# EAGLE design esphome-lg-pqrcuds0-rev1 (EAGLE 9.6.2)
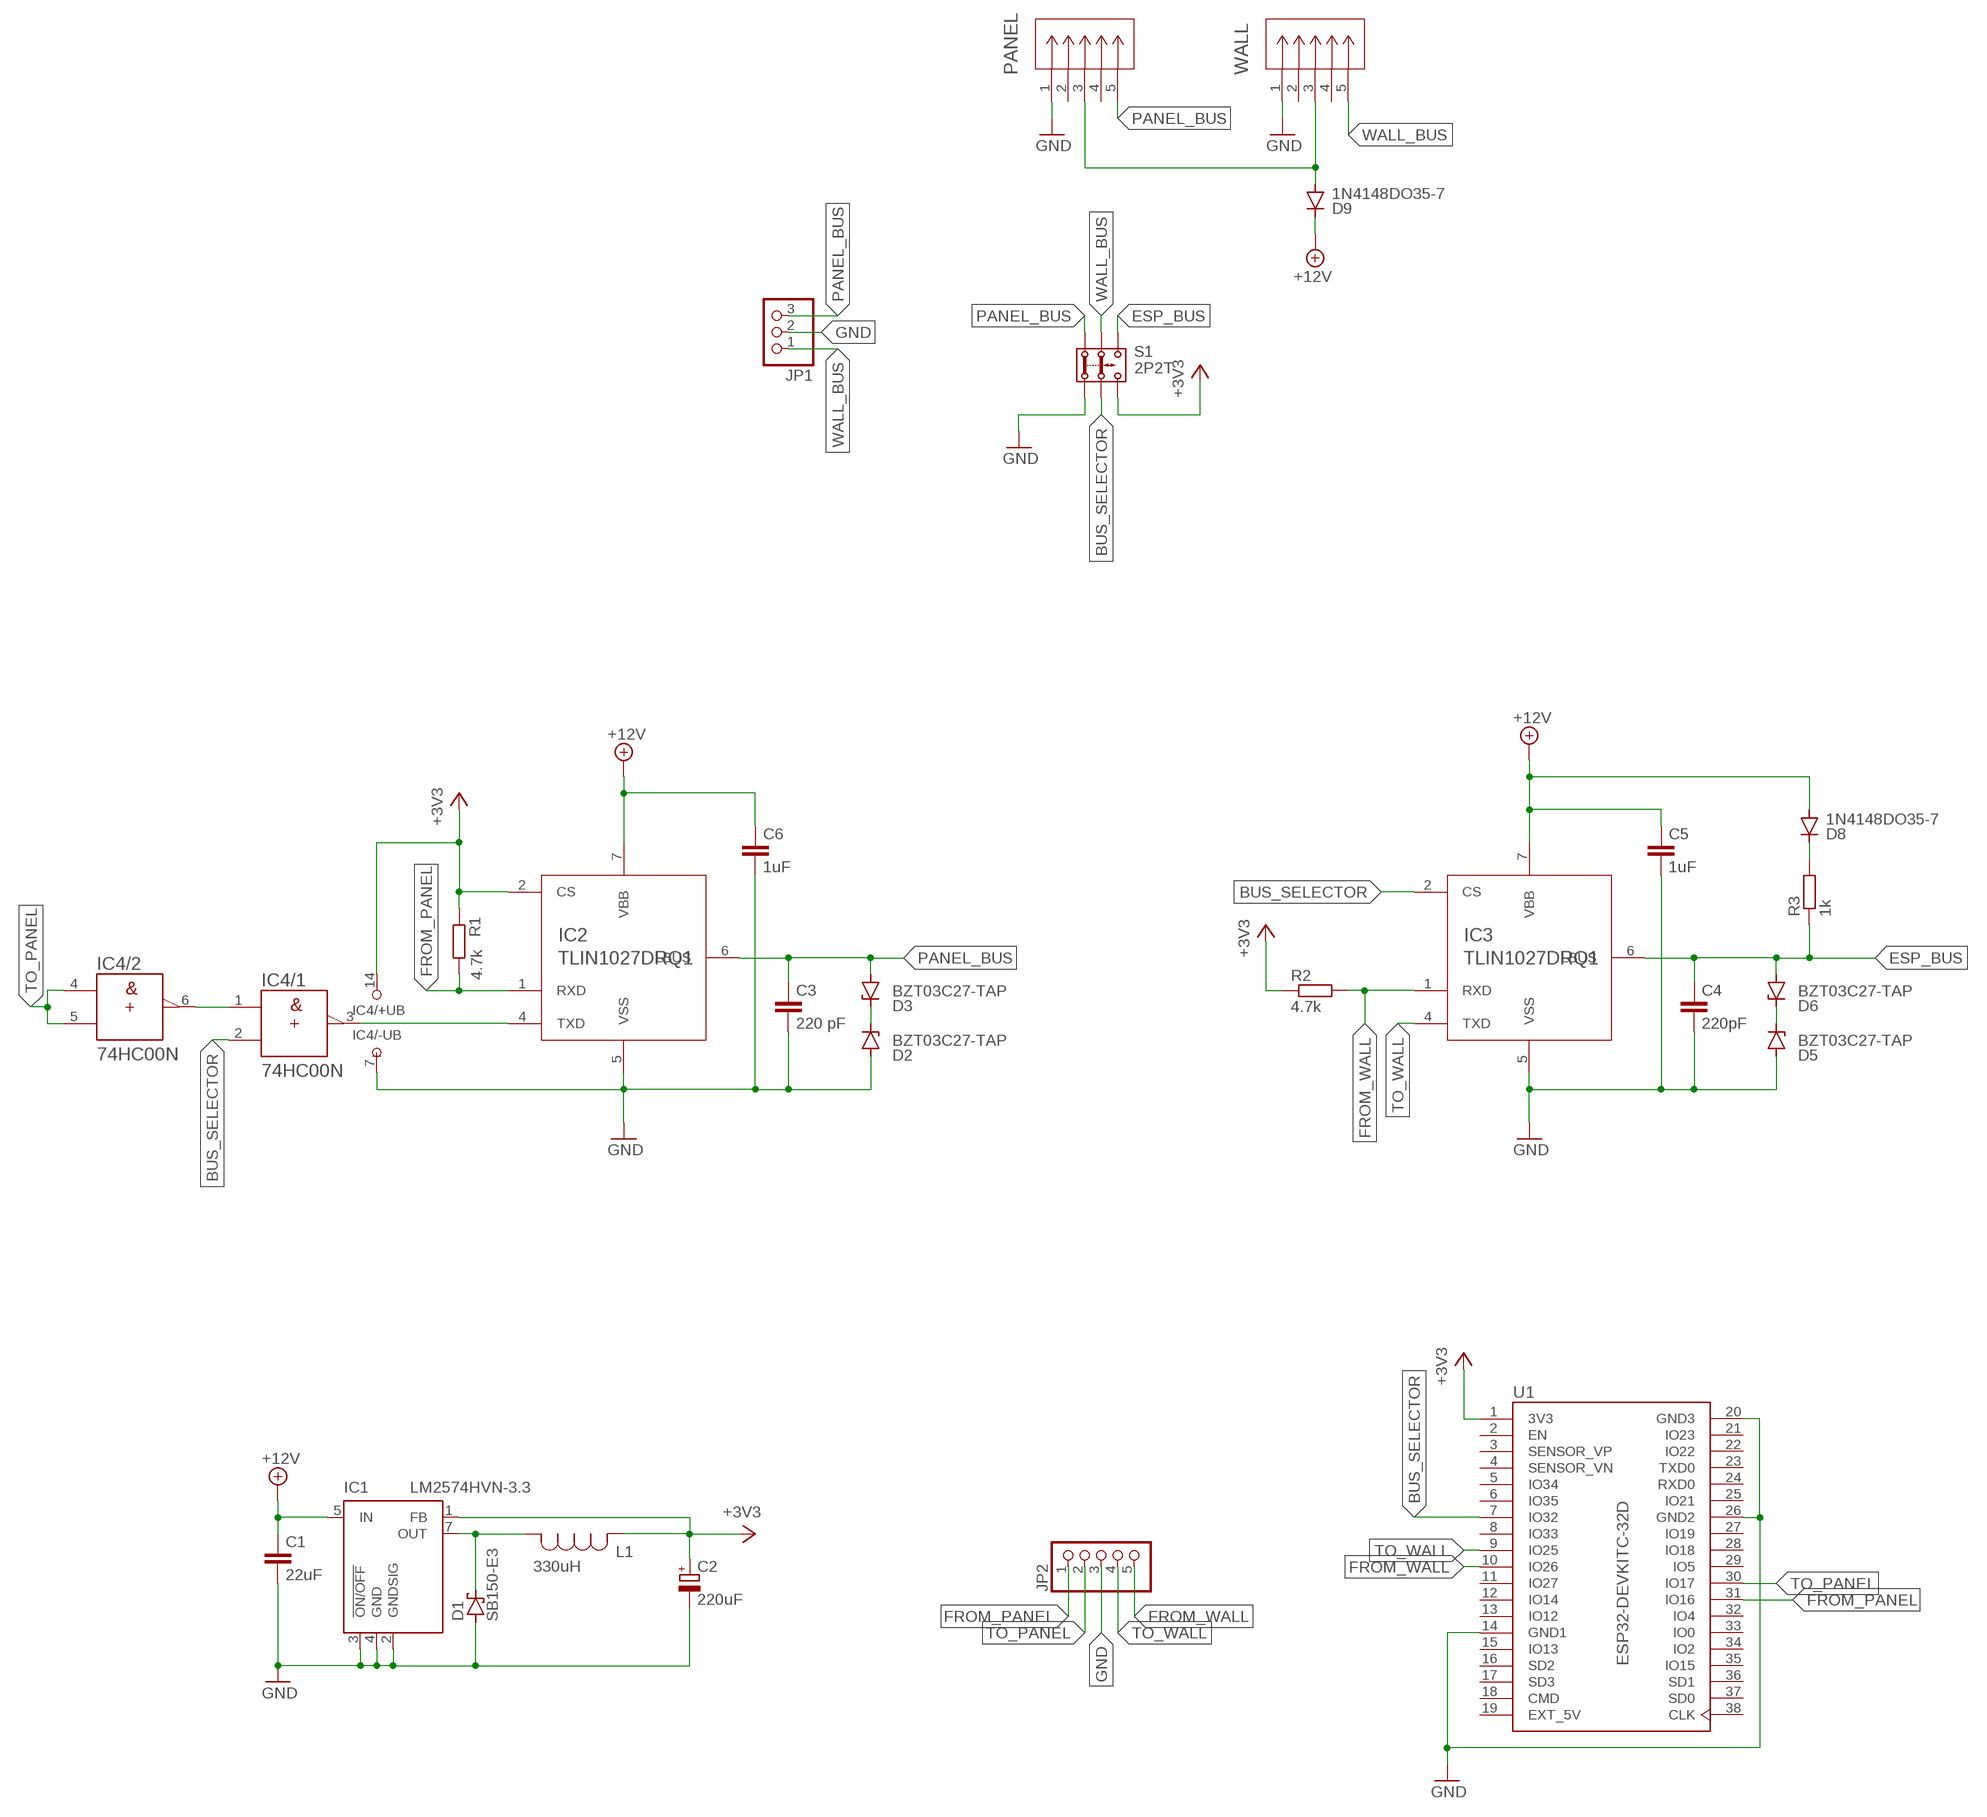
[diagram p0: schematic, sheet 1]

## Parts
C1  22uF  C-EU050-025X075  [C050-025X075]
C2  220uF  CPOL-EUE2,5-6E  [E2,5-6E]
C3  220 pF  C-EU050-025X075  [C050-025X075]
C4  220pF  C-EU050-025X075  [C050-025X075]
C5  1uF  C-EU050-025X075  [C050-025X075]
C6  1uF  C-EU050-025X075  [C050-025X075]
D1  SB150-E3  SCHOTTKY-DIODEDO35-7  [DO35-7]
D2  BZT03C27-TAP  ZENER-DIODESOD57-10  [SOD57Z10]
D3  BZT03C27-TAP  ZENER-DIODESOD57-10  [SOD57Z10]
D5  BZT03C27-TAP  ZENER-DIODESOD57-10  [SOD57Z10]
D6  BZT03C27-TAP  ZENER-DIODESOD57-10  [SOD57Z10]
D8  1N4148DO35-7  [DO35-7]
D9  1N4148DO35-7  [DO35-7]
IC1  LM2574HVN-3.3  [DIL08]
IC2  TLIN1027DRQ1  [SOIC8]
IC3  TLIN1027DRQ1  [SOIC8]
IC4  74HC00N  [DIL14]
JP1  PINHD-1X3/90  [1X03/90]
JP2  PINHD-1X5/90  [1X05/90]
L1  330uH  AIAP-02-331K  [AIAP-02_ABR]
PANEL  S5B-ZR(LF)(SN)  [CONN_S5B-ZR_JST]
R1  4.7k  R-EU_0204/7  [0204/7]
R2  4.7k  R-EU_0204/7  [0204/7]
R3  1k  R-EU_0204/7  [0204/7]
S1  2P2T  [2P2T]
U1  ESP32-DEVKITC-32D  [MODULE_ESP32-DEVKITC-32D]
WALL  S5B-ZR(LF)(SN)  [CONN_S5B-ZR_JST]

## Nets
+3V3: C2.+ IC1.1(FB) IC2.2(CS) IC4.14(/+UB:+UB) L1.2 R1.1 R2.1 S1.3.2 U1.1(3V3)
+12V: C1.1 C5.1 C6.1 D8.A D9.C IC1.5(IN) IC2.7(VBB) IC3.7(VBB)
BUS_SELECTOR: IC3.2(CS) IC4.2(/1:B) S1.2.2 U1.7(IO32)
ESP_BUS: C4.1 D6.A IC3.6(LBUS) R3.1 S1.3.1
FROM_PANEL: IC2.1(RXD) JP2.1 R1.2 U1.31(IO16)
FROM_WALL: IC3.1(RXD) JP2.5 R2.2 U1.10(IO26)
GND: C1.2 C2.- C3.2 C4.2 C5.2 C6.2 D1.A D2.A D5.A IC1.2(GNDSIG) IC1.3(!ON/OFF) IC1.4(GND) IC2.5(VSS) IC3.5(VSS) IC4.7(/-UB:-UB) JP1.2 JP2.3 PANEL.1 S1.1.2 U1.14(GND1) U1.20(GND3) U1.26(GND2) WALL.1
N$2: D1.C IC1.7(OUT) L1.1
N$3: D8.C R3.2
N$4: IC2.4(TXD) IC4.3(/1:Y)
N$5: IC4.1(/1:A) IC4.6(/2:Y)
N$6: D9.A PANEL.3 WALL.3
N$7: D2.C D3.C
N$8: D5.C D6.C
PANEL_BUS: C3.1 D3.A IC2.6(LBUS) JP1.3 PANEL.5 S1.1.1
TO_PANEL: IC4.4(/2:A) IC4.5(/2:B) JP2.2 U1.30(IO17)
TO_WALL: IC3.4(TXD) JP2.4 U1.9(IO25)
WALL_BUS: JP1.1 S1.2.1 WALL.5
Unconnected: IC4.8(/3:Y) IC4.9(/3:A) IC4.10(/3:B) IC4.11(/4:Y) IC4.12(/4:A) IC4.13(/4:B) PANEL.2 PANEL.4 U1.2(EN) U1.3(SENSOR_VP) U1.4(SENSOR_VN) U1.5(IO34) U1.6(IO35) U1.8(IO33) U1.11(IO27) U1.12(IO14) U1.13(IO12) U1.15(IO13) U1.16(SD2) U1.17(SD3) U1.18(CMD) U1.21(IO23) U1.22(IO22) U1.23(TXD0) U1.24(RXD0) U1.25(IO21) U1.27(IO19) U1.28(IO18) U1.29(IO5) U1.32(IO4) U1.33(IO0) U1.34(IO2) U1.35(IO15) U1.36(SD1) U1.37(SD0) U1.38(CLK) WALL.2 WALL.4

## Power pins joined to a net without a drawn wire
EXT_5V: U1.19(EXT_5V)

## Library data of the parts
C1 C3-C6 = rcl:C-EU: CAPACITOR, European symbol; SPICEPREFIX: C
C2 = rcl:CPOL-EU: POLARIZED CAPACITOR, European symbol; SPICEPREFIX: C
D1 = diode:SCHOTTKY-DIODE: Schottky Diode
D2 D3 D5 D6 = diode:ZENER-DIODE: Z-Diode
D8 D9 = diode:1N4148: DIODE high speed (Philips)
IC1 = linear:LM2574?-*: SIMPLE SWITCHER 0.5A Step-Down Voltage Regulator Source: http://cache.national.com/ds/LM/LM2574.pdf
IC2 IC3 = flameeyes:TLIN1027DRQ1
IC4 = 74ttl-din:74*00: Quad 2-input NAND gate
JP1 = pinhead:PINHD-1X3: PIN HEADER
JP2 = pinhead:PINHD-1X5: PIN HEADER
L1 = flameeyes:AIAP-02-331K; BUILT_BY: EMA_UL_Team; MANUFACTURER_PART_NUMBER: AIAP-02-331K; SOURCELIBRARY: Abracon_2013_02_05_AIAP_Series; VENDOR: Abracon
PANEL WALL = flameeyes:S5B-ZR(LF)(SN); BUILT_BY: EMA_Cory; COPYRIGHT: Copyright (C) 2018 Accelerated Designs. All rights reserved; DATASHEET: https://www.jst-mfg.com/product/pdf/eng/eZH.pdf; MANUFACTURER_PART_NUMBER: S5B-ZR(LF)(SN); SOURCELIBRARY: Add_to_database_2021-03-29; VENDOR: JST
R1-R3 = rcl:R-EU_: RESISTOR, European symbol; SPICEPREFIX: R
S1 = switch:2P2T: SLIDE SWITCH 2P2T Part No. SS-22F05-G(A)4 Source: CANAL ELECTRONIC CO., LTD .. switsch.pdf
U1 = ESP32-DEVKITC-32D:ESP32-DEVKITC-32D: Eval Board For Esp-Wroom-32 Check prices <https://pricing.snapeda.com/parts/ESP32-DEVKITC-32D/Espressif%20Systems/view-part?ref=eda>; AVAILABILITY: Warning; DESCRIPTION: WiFi Development Tools (802.11) ESP32 General Development Kit, ESP32-WROOM-32D on the board; MF: Espressif Systems; MP: ESP32-DEVKITC-32D; PACKAGE: None; PRICE: None; PURCHASE-URL: https://pricing.snapeda.com/search/part/ESP32-DEVKITC-32D/?ref=eda

## Board
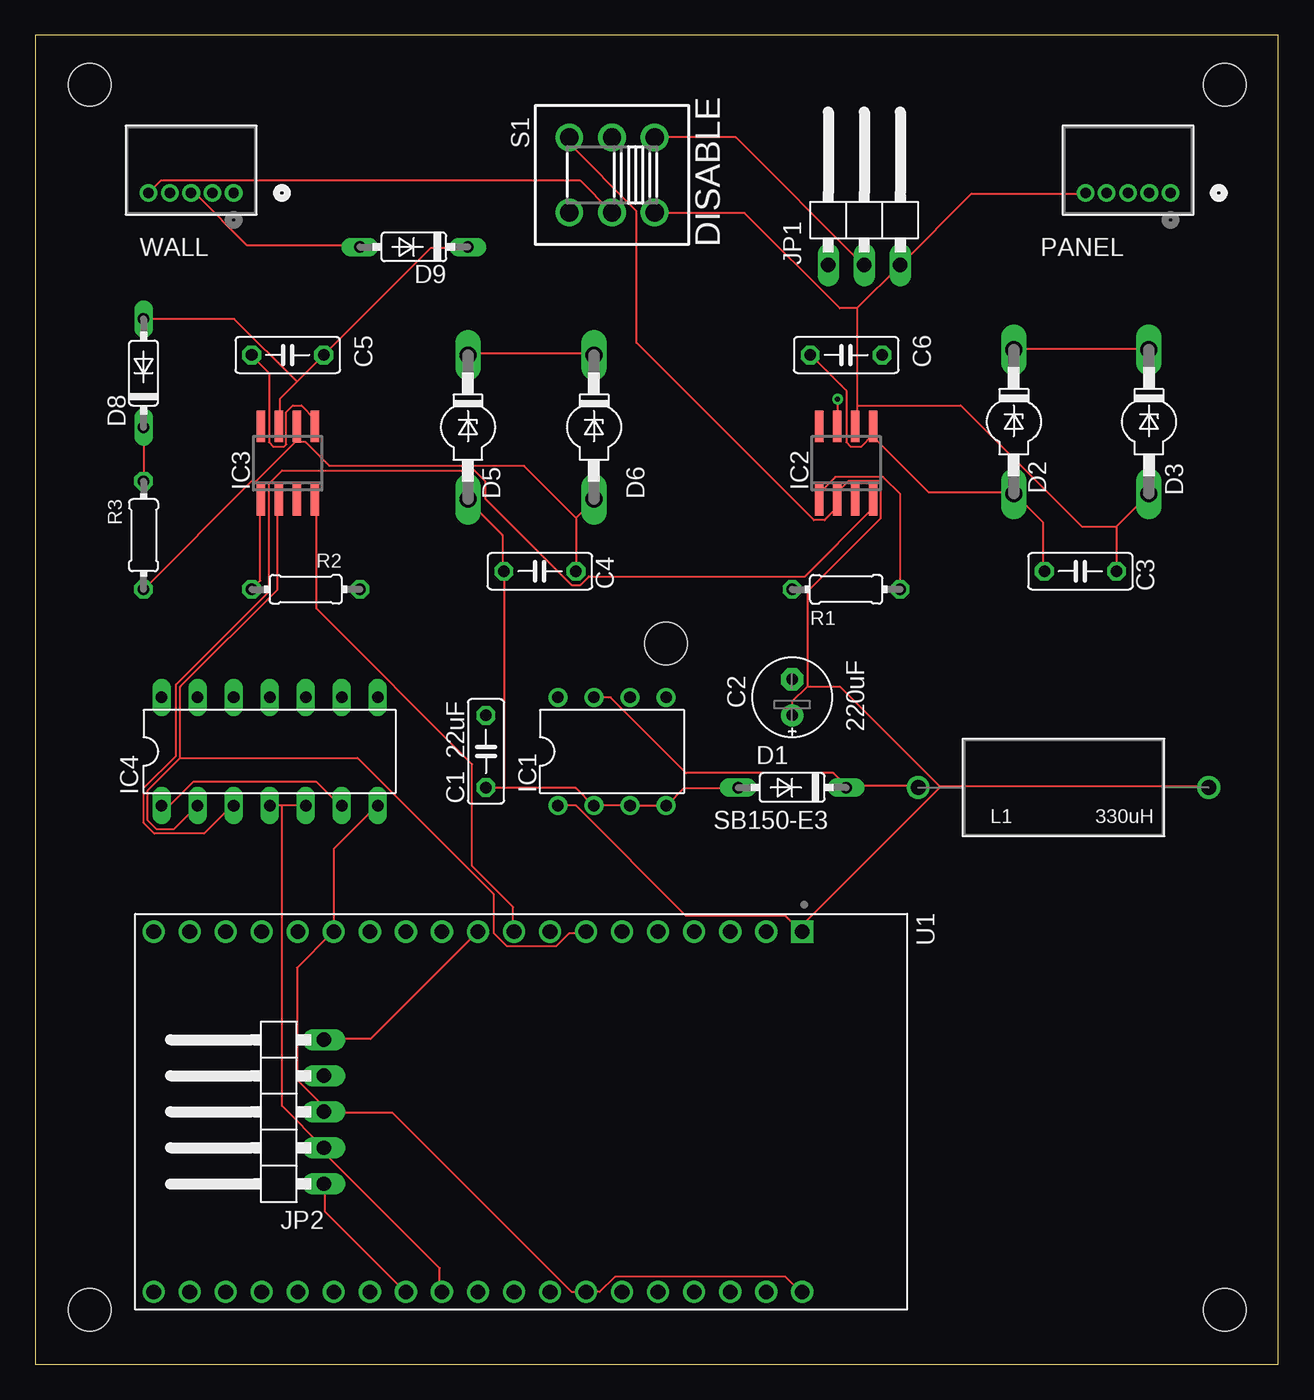
[diagram p1: board, top side]
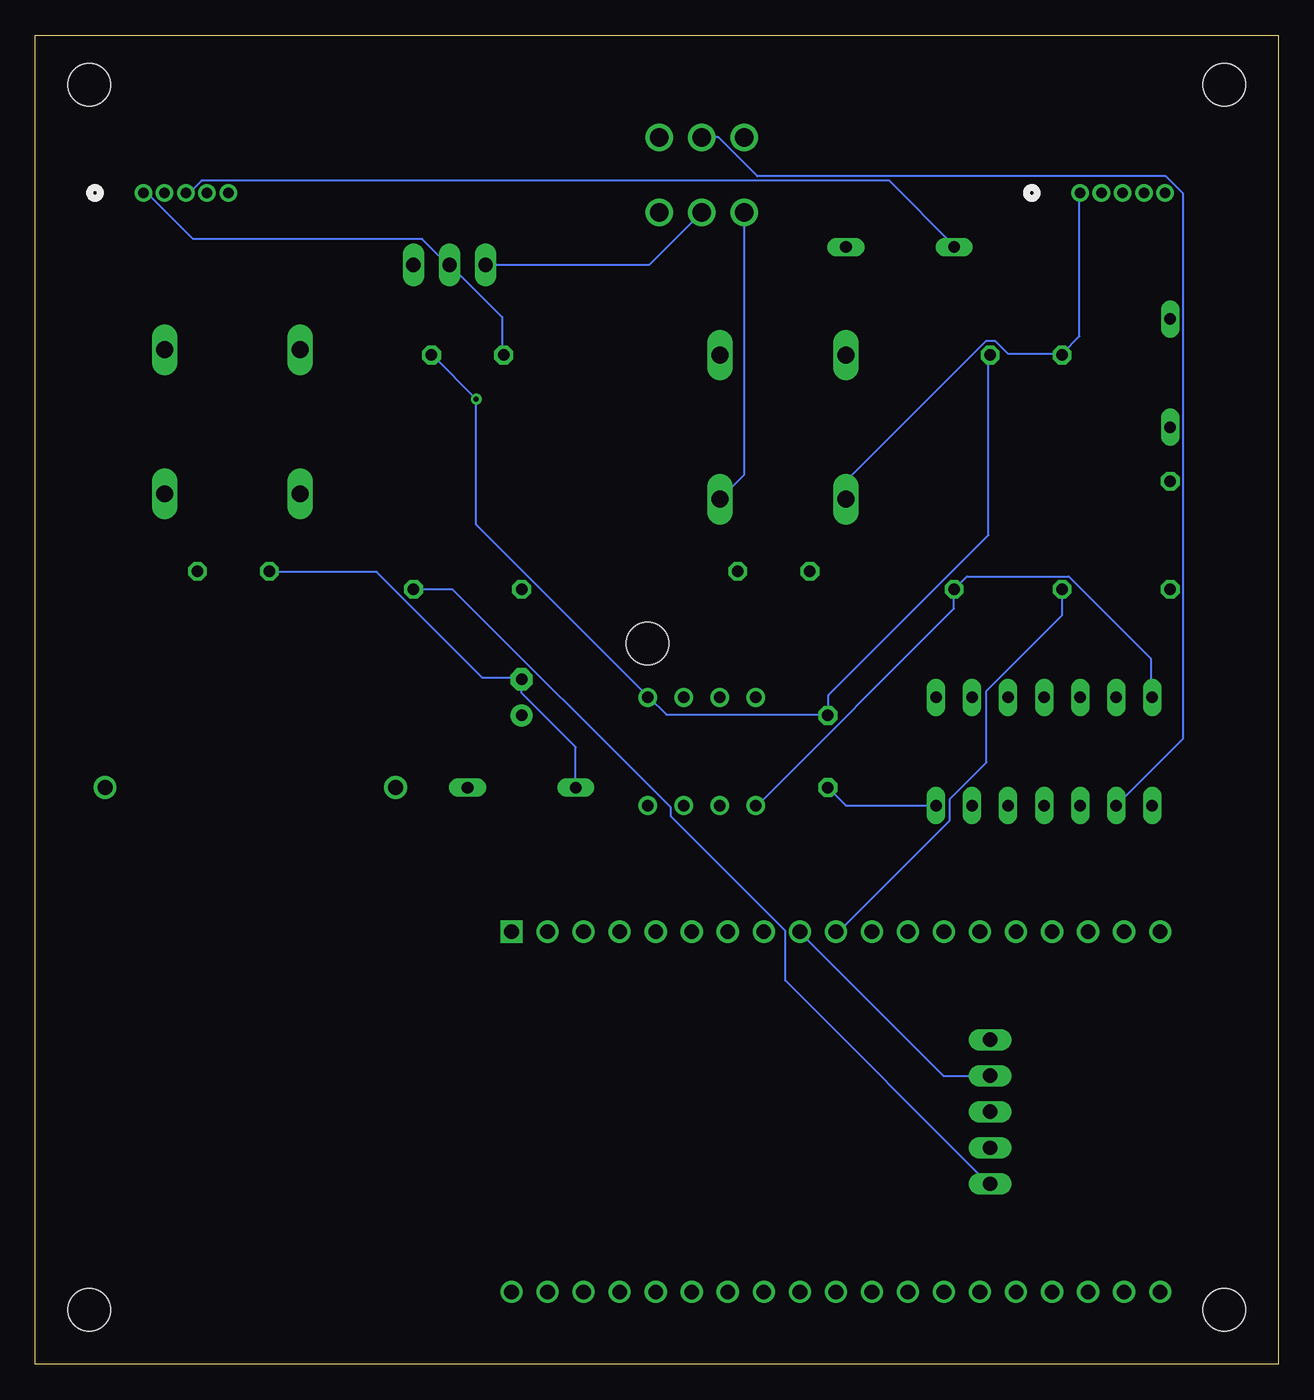
[diagram p2: board, bottom side, seen from below]

Size 87.61 x 93.65 mm. Coordinates in mm from the lower left corner, seen from the top.
Outline: 0,0 87.61,0 87.61,93.65 0,93.65 0,0
Copper layers (1*16): Top 0.035mm / dielectric 1.5mm / Bottom 0.035mm
Design rules "default": minimum track width 6mil, minimum drill 0.35mm, track to track 6mil, track to pad 6mil, pad to pad 6mil, via to via 6mil, smd to smd 6mil, copper to edge 40mil, drill to drill 6mil, minimum pad ring 10mil, minimum via ring 8mil, stop-mask expansion 4mil, vias tented up to drill 0mil, thermal gap 10mil
Holes 3 mm at 83.82,3.81 3.81,3.81 3.81,90.17 83.82,90.17 44.45,50.8

### Footprints (pad centres in the part's own frame; a part is rotated, then mirrored left to right if it is on the bottom)
C050-025X075 = drill 0.813 octagon: 1 -2.54,0; 2 2.54,0
E2,5-6E = drill 0.813 pad 1.575: + -1.27,0 | drill 0.813 pad 1.575 octagon: - 1.27,0
DO35-7 = drill 0.813 long: A 3.81,0; C -3.81,0
SOD57Z10 = drill 1.194 long: A 5.08,0; C -5.08,0
DIL08 = drill 0.813 pad 1.27: 1 -3.81,-3.81; 2 -1.27,-3.81; 3 1.27,-3.81; 4 3.81,-3.81; 5 3.81,3.81; 6 1.27,3.81; 7 -1.27,3.81; 8 -3.81,3.81
SOIC8 = smd 0.6 x 2.2: 1 -1.905,-2.6; 2 -0.635,-2.6; 3 0.635,-2.6; 4 1.905,-2.6; 5 1.905,2.6; 6 0.635,2.6; 7 -0.635,2.6; 8 -1.905,2.6
DIL14 = drill 0.813 long: 1 -7.62,-3.81; 2 -5.08,-3.81; 3 -2.54,-3.81; 4 0,-3.81; 5 2.54,-3.81; 6 5.08,-3.81; 7 7.62,-3.81; 8 7.62,3.81; 9 5.08,3.81; 10 2.54,3.81; 11 0,3.81; 12 -2.54,3.81; 13 -5.08,3.81; 14 -7.62,3.81
1X03/90 = drill 1.016 long: 1 -2.54,-3.81; 2 0,-3.81; 3 2.54,-3.81
1X05/90 = drill 1.016 long: 1 -5.08,-3.81; 2 -2.54,-3.81; 3 0,-3.81; 4 2.54,-3.81; 5 5.08,-3.81
AIAP-02_ABR = drill 1.067 pad 1.575: 1 0,0; 2 20.472,0
CONN_S5B-ZR_JST = drill 0.737 pad 1.245: 1 0,0; 2 1.499,0; 3 2.997,0; 4 4.496,0; 5 5.994,0
0204/7 = drill 0.813 octagon: 1 -3.81,0; 2 3.81,0
2P2T = drill 1.3 pad 1.93: 1.1 -3,2.65; 1.2 -3,-2.65; 2.1 0,2.65; 2.2 0,-2.65; 3.1 3,2.65; 3.2 3,-2.65
MODULE_ESP32-DEVKITC-32D = drill 1.04 square: 1 -12.7,19.76 | drill 1.04: 2 -12.7,17.22; 3 -12.7,14.68; 4 -12.7,12.14; 5 -12.7,9.6; 6 -12.7,7.06; 7 -12.7,4.52; 8 -12.7,1.98; 9 -12.7,-0.56; 10 -12.7,-3.1; 11 -12.7,-5.64; 12 -12.7,-8.18; 13 -12.7,-10.72; 14 -12.7,-13.26; 15 -12.7,-15.8; 16 -12.7,-18.34; 17 -12.7,-20.88; 18 -12.7,-23.42; 19 -12.7,-25.96; 20 12.7,19.76; 21 12.7,17.22; 22 12.7,14.68; 23 12.7,12.14; 24 12.7,9.6; 25 12.7,7.06; 26 12.7,4.52; 27 12.7,1.98; 28 12.7,-0.56; 29 12.7,-3.1; 30 12.7,-5.64; 31 12.7,-8.18; 32 12.7,-10.72; 33 12.7,-13.26; 34 12.7,-15.8; 35 12.7,-18.34; 36 12.7,-20.88; 37 12.7,-23.42; 38 12.7,-25.96

### Placement (x,y rotation side)
C1  31.75,43.18 270 top
C2  53.34,46.99 90 top
C3  73.66,55.88 180 top
C4  35.56,55.88 180 top
C5  17.78,71.12 180 top
C6  57.15,71.12 180 top
D1  53.34,40.64 180 top
D2  68.96,66.42 270 top
D3  78.49,66.42 270 top
D5  30.48,66.04 270 top
D6  39.37,66.04 270 top
D8  7.62,69.85 90 top
D9  26.67,78.74 180 top
IC1  40.64,43.18 0 top
IC2  57.15,63.5 0 top
IC3  17.78,63.5 0 top
IC4  16.51,43.18 0 top
JP1  58.42,81.28 0 top
JP2  16.51,17.78 90 top
L1  62.23,40.64 0 top
PANEL  80.01,82.55 180 top
R1  57.15,54.61 0 top
R2  19.05,54.61 180 top
R3  7.62,58.42 90 top
S1  40.64,83.82 180 top
U1  34.29,17.78 270 top
WALL  13.97,82.55 180 top

### Tracks (layer width: path | path; a pad name or v marks a point on that pad's centre or on a via)
+3V3
  Top 0.152: IC1.1 38.1,39.37 45.87,31.6 52.88,31.6 53.8,30.68 | 53.8,30.68 53.95,30.53 U1.1 53.8,30.68 | R1.1 54.41,54.61 | 54.41,54.61 54.56,54.61 59.59,59.64 59.59,62.23 57.3,62.23 56.54,61.47 56.54,61.01 IC2.2 56.39,60.86 56.39,60.25 55.63,59.49 54.86,59.49 42.37,71.98 42.37,81.28 37.64,86 S1.3.2 | C2.+ 53.34,46.69 54.41,47.75 | 54.41,54.61 54.41,47.75 | 63.86,40.74 63.7,40.74 56.69,47.75 54.41,47.75 | 63.86,40.74 82.6,40.74 L1.2 | 63.86,40.74 53.8,30.68
  Bottom 0.152: IC4.14 8.99,46.99 8.99,49.73 14.78,55.52 21.95,55.52 R2.1 22.86,53.24 36.73,39.37 IC1.1
+12V  (via drill 0.35)
  Top 0.152: 18.44,69.24 C5.1 27.89,78.69 30.48,78.69 D9.C | 18.44,69.24 17.22,68.02 17.22,66.19 IC3.7 | D8.A 14.02,73.66 18.44,69.24 | v56.54,68.02 56.54,66.19 IC2.7
  Bottom 0.152: C6.1 59.59,71.07 v56.54,68.02 56.54,59.18 44.35,46.99 | 44.35,46.99 43.13,45.77 31.85,45.77 C1.1 31.7,45.77 31.7,47.14 20.42,58.42 20.42,71.07 C5.1 | 44.35,46.99 IC1.5
BUS_SELECTOR
  Top 0.152: 10.21,42.72 10.21,47.75 17.07,54.61 17.07,60.86 IC3.2 | 10.21,42.72 7.93,40.44 7.93,38.3 8.53,37.69 9.75,37.69 IC4.2 | 10.21,42.72 22.71,42.72 32.31,33.12 32.31,30.38 33.22,29.46 36.73,29.46 37.64,30.38 38.71,30.38 U1.7
  Bottom 0.152: IC4.2 6.71,44.09 6.71,82.5 7.93,83.72 36.73,83.72 39.47,86.46 40.54,86.46 S1.2.2
ESP_BUS
  Top 0.152: 18.29,64.97 18.29,66.04 IC3.6 | 18.29,64.97 15.54,62.23 15.24,62.23 R3.1 | 38.1,59.64 C4.1 | 38.1,59.64 39.32,60.86 D6.A | 18.29,64.97 19.05,64.97 20.73,63.3 34.44,63.3 38.1,59.64
  Bottom 0.152: D6.A 37.64,62.69 37.64,81.13 S1.3.1
FROM_PANEL
  Top 0.152: R1.2 60.96,61.32 59.74,62.54 56.39,62.54 55.32,61.47 55.32,61.01 IC2.1 | JP2.1 20.42,12.7 20.42,10.72 26.06,5.08 U1.31
  Bottom 0.152: R1.2 58.22,54.61 42.82,39.22 42.82,38.61 34.75,30.53 34.75,27.03 20.42,12.7 JP2.1
FROM_WALL
  Top 0.152: R2.2 15.85,55.22 15.85,60.86 IC3.1 | JP2.5 20.42,22.91 23.62,22.91 31.09,30.38 U1.10
  Bottom 0.152: R2.2 15.24,52.78 20.57,47.45 20.57,42.42 23.16,39.83 23.16,38.3 31.09,30.38 U1.10
GND
  Top 0.152: C3.2 71.02,55.98 71.02,59.33 69.04,61.32 D2.A 68.89,61.47 62.94,61.47 58.98,65.43 | 58.98,65.43 58.98,66.04 IC2.5 58.98,65.43 | 58.98,65.43 58.22,64.67 57.46,64.67 57.15,64.97 57.15,68.63 54.71,71.07 C6.2 | S1.1.2 43.74,86.46 49.38,86.46 58.37,77.47 JP1.2 | IC3.5 19.66,66.19 19.66,66.65 18.75,67.56 18.14,67.56 17.68,67.11 17.68,64.82 17.53,64.67 16.76,64.67 16.46,64.97 16.46,69.85 15.24,71.07 C5.2 | U1.20 53.95,5.08 52.88,6.15 40.84,6.15 39.78,5.08 U1.26 37.8,5.08 25.15,17.73 20.42,17.73 JP2.3 20.27,17.88 20.27,18.19 18.44,20.02 18.44,27.94 20.88,30.38 U1.14 21.03,30.53 21.03,36.32 24.08,39.37 IC4.7 | D5.A 30.48,60.86 32.92,58.42 32.92,55.98 C4.2 33.07,55.83 33.07,40.59 | D1.A 49.53,40.59 45.72,40.59 44.5,39.37 IC1.4 IC1.3 IC1.2 39.32,39.37 38.1,40.59 33.07,40.59 | 33.07,40.59 31.85,40.59 C1.2
  Bottom 0.152: PANEL.1 80.01,82.5 79.7,82.5 76.5,79.3 60.35,79.3 58.52,77.47 JP1.2 58.37,77.47 54.71,73.81 54.71,71.22 C6.2 | 15.24,71.22 14.02,72.44 14.02,82.5 WALL.1 | IC4.7 30.48,39.37 C1.2 | D1.A 49.53,43.49 53.34,47.3 C2.- 53.34,48.36 56.08,48.36 63.55,55.83 71.02,55.83 C3.2 | 15.24,71.22 19.05,71.22 19.96,72.14 20.57,72.14 30.48,62.23 D5.A | 15.24,71.22 C5.2
N$2
  Top 0.152: 57.15,40.74 62.18,40.74 L1.1 | IC1.7 40.54,46.99 45.87,41.66 56.24,41.66 57.15,40.74 | 57.15,40.74 D1.C
N$3
  Top 0.152: D8.C R3.2
N$4
  Top 0.152: IC2.4 58.98,60.86 58.98,60.25 54.25,55.52 39.01,55.52 38.41,54.92 37.8,54.92 31.7,61.01 31.7,62.23 30.94,62.99 17.37,62.99 16.46,62.08 16.46,54.46 9.91,47.9 9.91,42.88 7.62,40.59 7.62,38.15 8.38,37.39 11.89,37.39 13.87,39.37 IC4.3
N$5
  Top 0.152: IC4.1 9.45,39.37 11.12,41.05 19.81,41.05 21.49,39.37 IC4.6
N$6
  Top 0.152: WALL.3 10.97,82.5 11.28,82.5 14.94,78.84 22.86,78.84 D9.A
  Bottom 0.152: PANEL.3 76.96,82.65 76.66,82.65 75.89,83.41 27.43,83.41 22.86,78.84 D9.A
N$7
  Top 0.152: D2.C 69.04,71.53 78.49,71.53 D3.C
N$8
  Top 0.152: D5.C 30.48,71.22 39.32,71.22 D6.C
PANEL_BUS
  Top 0.152: 76.2,59.03 C3.1 | 76.2,59.03 78.49,61.32 D3.A | 57.91,74.42 57.91,67.56 | 57.91,67.56 57.91,66.19 IC2.6 | 57.91,74.42 JP1.3 65.99,82.5 73.91,82.5 PANEL.5 | 57.91,74.42 56.69,74.42 49.99,81.13 43.74,81.13 S1.1.1 | 76.2,59.03 73.76,59.03 65.23,67.56 57.91,67.56
TO_PANEL
  Top 0.152: IC4.5 17.37,39.37 | 17.37,39.37 IC4.4 | U1.30 28.5,5.08 28.5,6.76 20.42,14.83 20.42,15.14 JP2.2 17.37,18.19 17.37,39.37
TO_WALL
  Top 0.152: IC3.4 19.81,60.86 19.81,53.24 30.79,42.27 30.79,35.1 33.68,32.21 33.68,30.53 U1.9
  Bottom 0.152: JP2.4 23.62,20.32 33.68,30.38 U1.9
WALL_BUS
  Top 0.152: WALL.5 8.84,83.41 38.41,83.41 40.54,81.28 S1.2.1
  Bottom 0.152: JP1.1 44.35,77.47 40.69,81.13 S1.2.1

### Text on the board
tPlace: DISABLE